# EAGLE design openegg2 (EAGLE 6.1)
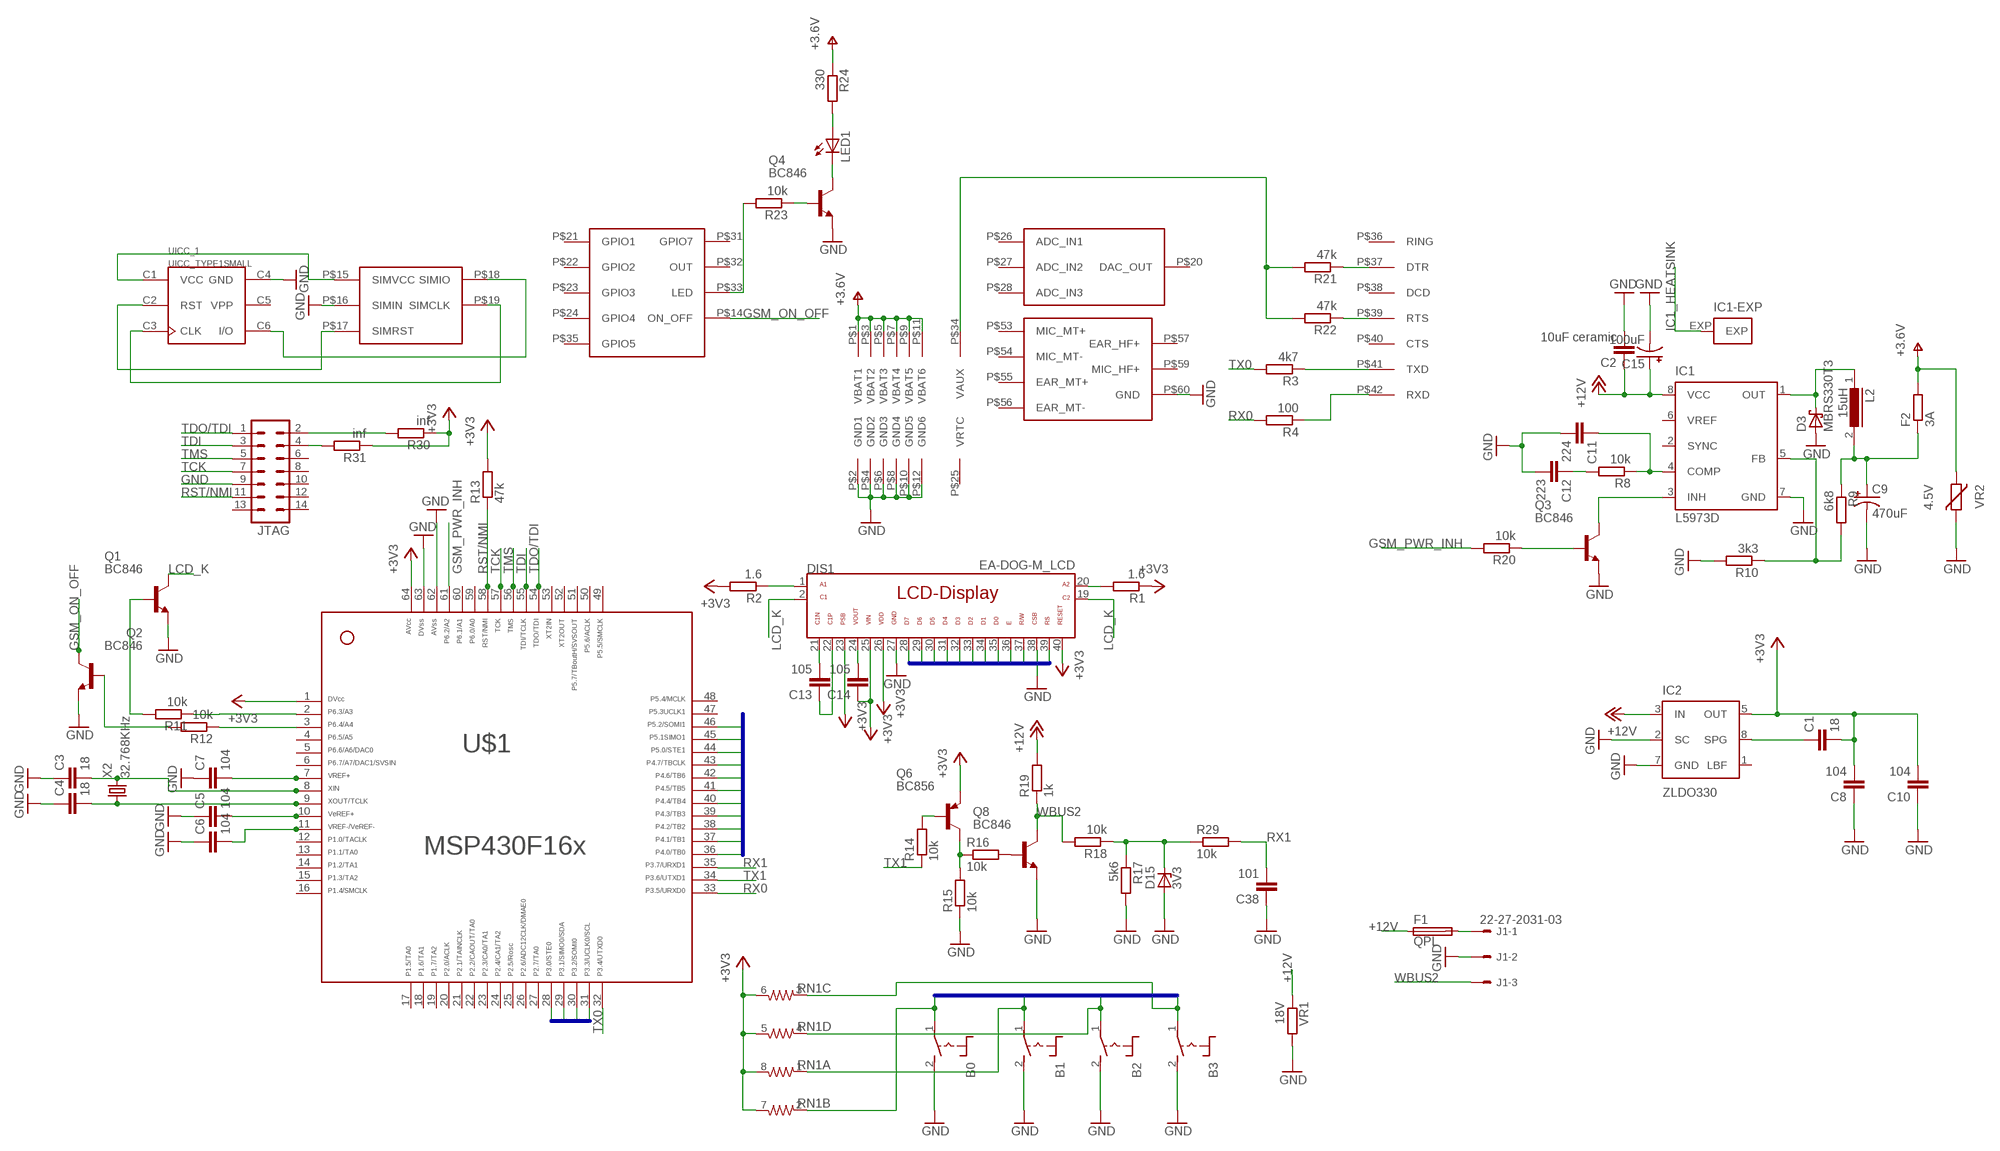
[diagram p0: schematic, sheet 1]

## Parts
B0  MARQ6424  [MARQ6424_NOLED]
B1  MARQ6424  [MARQ6424_NOLED]
B2  MARQ6424  [MARQ6424_NOLED]
B3  MARQ6424  [MARQ6424_NOLED]
C1  18  C-EUC0603  [C0603]
C2  10uF ceramic  C-EUC1210K  [C1210K]
C3  18  C-EUC0603  [C0603]
C4  18  C-EUC0603  [C0603]
C5  104  C-EUC0603  [C0603]
C6  104  C-EUC0603  [C0603]
C7  104  C-EUC0603  [C0603]
C8  104  C-EUC1206  [C1206]
C9  470uF  CPOL-USCT7343  [CT7343]
C10  104  C-EUC1206  [C1206]
C11  224  C-EUC0402  [C0402]
C12  223  C-EUC0402  [C0402]
C13  105  C-EUC1206  [C1206]
C14  105  C-EUC1206  [C1206]
C15  100uF  CPOL-US153CLV-0505  [153CLV-0505]
C38  101  C-EUC0402  [C0402]
D3  MBRS330T3  [SMC]
D15  3V3  ZENER-DIODESOD80C  [SOD80C]
DIS1  EA-DOG-M_LCD  [EA-DOG-M_LCD]
F1  QPL  [QPL]
F2  3A  R-EU_R2010  [R2010]
IC1  L5973D  [HSOP8]
IC2  ZLDO330  [SM8]
J1  22-27-2031-03  [6410-03]
JTAG  MA07-2  [MA07-2]
L2  15uH  DR127  [DR127]
LED1  LEDCHIP-LED0603  [CHIP-LED0603]
Q1  BC846  BC846ALT1SMD  [SOT23]
Q2  BC846  BC846ALT1SMD  [SOT23]
Q3  BC846  BC846ALT1SMD  [SOT23]
Q4  BC846  BC846ALT1SMD  [SOT23]
Q6  BC856  BC856ALT1SMD  [SOT23-BEC]
Q8  BC846  BC846ALT1SMD  [SOT23]
R1  1.6  R-EU_R1206  [R1206]
R2  1.6  R-EU_R1206  [R1206]
R3  4k7  R-EU_R0603  [R0603]
R4  100  R-EU_R0603  [R0603]
R8  10k  R-EU_R0603  [R0603]
R9  6k8  R-EU_R0603  [R0603]
R10  3k3  R-EU_R0603  [R0603]
R11  10k  R-EU_R0603  [R0603]
R12  10k  R-EU_R0603  [R0603]
R13  47k  R-EU_R0603  [R0603]
R14  10k  R-EU_R0603  [R0603]
R15  10k  R-EU_R0603  [R0603]
R16  10k  R-EU_R0603  [R0603]
R17  5k6  R-EU_R0603  [R0603]
R18  10k  R-EU_R0603  [R0603]
R19  1k  R-EU_R0603  [R0603]
R20  10k  R-EU_R0603  [R0603]
R21  47k  R-EU_R0603  [R0603]
R22  47k  R-EU_R0603  [R0603]
R23  10k  R-EU_R0603  [R0603]
R24  330  R-EU_R0603  [R0603]
R29  10k  R-EU_R0603  [R0603]
R30  inf  R-EU_R0603  [R0603]
R31  inf  R-EU_R0603  [R0603]
RN1  742-8_S  [742-8]
U$1  F16X---PM64  [PM/PAG64]
U$2  GC864-QUAD-C2SMD  [GC864-QUAD-C2_SMD]
UICC_1  UICC_TYPE1SMALL  [UICC_READER2]
VR1  18V  R-EU_R2010  [R2010]
VR2  4.5V  VARISTORCN1812  [CT/CN1812]
X2  32.768KHz  CRYSTALTC26V  [TC26V]

## Nets
+3V3: C1.2 C8.2 C10.2 C14.1 DIS1.23 DIS1.25 DIS1.26 DIS1.40 IC2.5(OUT) Q6.E R1.1 R2.2 R13.2 R30.1 R31.1 RN1.5 RN1.6 RN1.7 RN1.8 U$1.1 U$1.64
+12V [+12V]: C2.1 C15.+ F1.1 IC1.8(VCC) IC2.3(IN) R19.2 VR1.1
B0: B0.1(P) RN1.2 U$1.30
B1: B1.1(P) RN1.1 U$1.31
B2: B2.1(P) RN1.4 U$1.28
B3: B3.1(P) RN1.3 U$1.29
D0: DIS1.35 U$1.36
D1: DIS1.34 U$1.37
D2: DIS1.33 U$1.38
D3: DIS1.32 U$1.39
D4: DIS1.31 U$1.40
D5: DIS1.30 U$1.41
D6: DIS1.29 U$1.42
D7: DIS1.28 U$1.43
E: DIS1.36 U$1.45
GND: B0.2(S) B1.2(S) B2.2(S) B3.2(S) C2.2 C3.1 C4.1 C5.1 C6.1 C7.1 C8.1 C9.- C10.1 C11.2 C12.2 C15.- C38.1 D3.A D15.A DIS1.27 DIS1.38 IC1.7(GND) IC2.2(SC) IC2.7(GND) J1.2 JTAG.9 Q1.2(E) Q2.2(E) Q3.2(E) Q4.2(E) Q8.2(E) R10.2 R15.1 R17.2 U$1.62 U$1.63 U$2.P$2(GND1) U$2.P$4(GND2) U$2.P$6(GND3) U$2.P$8(GND4) U$2.P$10(GND5) U$2.P$12(GND6) U$2.P$16(SIMIN) U$2.P$60(GND) UICC_1.C4(GND) VR1.2 VR2.1
GSM_ON_OFF: Q2.3(C) U$2.P$14(ON_OFF)
GSM_PWR_INH: R20.2 U$1.61
IC1_HEATSINK: IC1.EXP
LCD_K: DIS1.2 DIS1.19 Q1.3(C)
N$1: DIS1.1 R2.1
N$2: DIS1.20 R1.2
N$3: R3.1 U$2.P$41(TXD)
N$4: R4.1 U$2.P$42(RXD)
N$6: C1.1 IC2.8(SPG)
N$7: C4.2 U$1.9 X2.1
N$8: JTAG.2 R30.2
N$9: JTAG.4 R31.2
N$12: IC1.5(FB) R9.2 R10.1
N$13: C9.+ F2.1 L2.2 R9.1
N$15: D3.C IC1.1(OUT) L2.1
N$16: C11.1 IC1.4(COMP) R8.1
N$17: C12.1 R8.2
N$18: R11.1 U$1.2
N$19: Q1.1(B) R11.2
N$20: R12.1 U$1.3
N$21: Q2.1(B) R12.2
N$22: C13.2 DIS1.21
N$23: C13.1 DIS1.22
N$24: Q3.1(B) R20.1
N$25: C14.2 DIS1.24
N$26: C3.2 U$1.8 X2.2
N$27: Q6.B R14.2
N$28: Q6.C R15.2 R16.1
N$29: C5.2 U$1.10
N$30: C6.2 U$1.11
N$31: C7.2 U$1.7
N$32: IC1.3(INH) Q3.3(C)
N$33: Q8.1(B) R16.2
N$34: F1.2 J1.1
N$35: R22.1 U$2.P$39(RTS)
N$36: R21.1 U$2.P$37(DTR)
N$37: R21.2 R22.2 U$2.P$34(VAUX)
N$38: R23.2 U$2.P$33(LED)
N$39: LED1.A R24.2
N$40: Q4.1(B) R23.1
N$41: LED1.C Q4.3(C)
NET$22: D15.C R17.1 R18.1 R29.1
RS: DIS1.39 U$1.46
RST/NMI: JTAG.11 R13.1 U$1.58
RW: DIS1.37 U$1.44
RX0: R4.2 U$1.33
RX1: C38.2 R29.2 U$1.35
SIMCLK: U$2.P$19(SIMCLK) UICC_1.C3(CLK)
SIMIO: U$2.P$18(SIMIO) UICC_1.C6(I/O)
SIMRST: U$2.P$17(SIMRST) UICC_1.C2(RST)
SIMVCC: U$2.P$15(SIMVCC) UICC_1.C1(VCC)
TCK: JTAG.7 U$1.57
TDI: JTAG.3 U$1.55
TDO/TDI: JTAG.1 U$1.54
TMS: JTAG.5 U$1.56
TX0: R3.2 U$1.32
TX1: R14.1 U$1.34
V+ [V+]: F2.2 R24.1 U$2.P$1(VBAT1) U$2.P$3(VBAT2) U$2.P$5(VBAT3) U$2.P$7(VBAT4) U$2.P$9(VBAT5) U$2.P$11(VBAT6) VR2.2 ; supply symbol labelled +3.6V
WBUS2: J1.3 Q8.3(C) R18.2 R19.1
Unconnected: IC1.2(SYNC) IC1.6(VREF) IC2.1(LBF) JTAG.6 JTAG.8 JTAG.10 JTAG.12 JTAG.13 JTAG.14 U$1.4 U$1.5 U$1.6 U$1.12 U$1.13 U$1.14 U$1.15 U$1.16 U$1.17 U$1.18 U$1.19 U$1.20 U$1.21 U$1.22 U$1.23 U$1.24 U$1.25 U$1.26 U$1.27 U$1.47 U$1.48 U$1.49 U$1.50 U$1.51 U$1.52 U$1.53 U$1.59 U$1.60 U$2.P$20(DAC_OUT) U$2.P$21(GPIO1) U$2.P$22(GPIO2) U$2.P$23(GPIO3) U$2.P$24(GPIO4) U$2.P$25(VRTC) U$2.P$26(ADC_IN1) U$2.P$27(ADC_IN2) U$2.P$28(ADC_IN3) U$2.P$31(GPIO7) U$2.P$32(OUT) U$2.P$35(GPIO5) U$2.P$36(RING) U$2.P$38(DCD) U$2.P$40(CTS) U$2.P$53(MIC_MT+) U$2.P$54(MIC_MT-) U$2.P$55(EAR_MT+) U$2.P$56(EAR_MT-) U$2.P$57(EAR_HF+) U$2.P$59(MIC_HF+) UICC_1.C5(VPP)

## Buses
D0,D1,D2,D3,D4,D5,D6,D7,RW,E,RS
B0,B1,B2,B3

## Library data of the parts
B0 B1-B3 = misc:MARQ6424
C1-C8 C10-C14 C38 = rcl:C-EU: CAPACITOR, European symbol
C9 C15 = rcl:CPOL-US: POLARIZED CAPACITOR, American symbol
D3 = diode:MBRS3*0T3: SCHOTTKY BARRIER RECTIFIER 3.0 AMPERES 20, 30, 40 VOLT Source: MBRS340T3-D.pdf
D15 = diode:ZENER-DIODE: Z-Diode
DIS1 = 1_USER:EA-DOG-M_LCD
F1 = fuse:QPL: Fuseholder for Micro(TM) Fuse or Pico(R) II Fuses 281 005, 281 008 Source:www.littlefuse.com .. 281005A.PDF; OC_FARNELL: 1608231; OC_NEWARK: unknown
F2 R1-R4 R8-R24 R29-R31 VR1 = rcl:R-EU_: RESISTOR, European symbol
IC1 = st-microelectronics:L5973D: 2.5 A switch step down switching regulator Source: Data sheet <http://www.st.com/internet/com/TECHNICAL_RESOURCES/TECHNICAL_LITERATURE/DATASHEET/CD00002851.pdf>; MF: STMICROELECTRONICS; MPN: L5973D; OC_FARNELL: 1077145
IC2 = 1_USER:ZLDO330
J1 = con-molex:22-?-03: CONNECTOR wire to board 2.54 mm (.1 inch) pitch header; OC_FARNELL: unknown; OC_NEWARK: unknown
JTAG = con-lstb:MA07-2: PIN HEADER
L2 = inductors-2:DR127: High Power Density, High Efficiency, Shielded Inductors Source: coiltronics_dr_series.pdf
LED1 = led:LED: LED OSRAM: - CHIPLED LG R971, LG N971, LY N971, LG Q971, LY Q971, LO R971, LY R971 LH N974, LH R974 LS Q976, LO Q976, LY Q976 LO Q996 - Hyper CHIPLED LW Q18S LB Q993, LB Q99A, LB R99A - SideLED LS A670, LO A670, LY A670, LG A670, LP A670 LB A673, LV A673, LT A673, LW A673 LH A674 LY A675 LS A676, LA A676, LO A676, LY A676, LW A676 LS A679, LY A679, LG A679 - Hyper Micro SIDELED® LS Y876, LA Y876, LO Y876, LY Y876 LT Y87S - SmartLED LW L88C, LW L88S LB L89C, LB L89S, LG L890 LS L89K, LO L89K, LY L89K LS L896, LA L896, LO L896, LY L896 - TOPLED LS T670, LO T670, LY T670, LG T670, LP T670 LSG T670, LSP T670, LSY T670, LOP T670, LYG T670 LG T671, LOG T671, LSG T671 LB T673, LV T673, LT T673, LW T673 LH T674 LS T676, LA T676, LO T676, LY T676, LB T676, LH T676, LSB T676, LW T676 LB T67C, LV T67C, LT T67C, LS T67K, LO T67K, LY T67K, LW E67C LS E67B, LA E67B, LO E67B, LY E67B, LB E67C, LV E67C, LT E67C LW T67C LS T679, LY T679, LG T679 LS T770, LO T770, LY T770, LG T770, LP T770 LB T773, LV T773, LT T773, LW T773 LH T774 LS E675, LA E675, LY E675, LS T675 LS T776, LA T776, LO T776, LY T776, LB T776 LHGB T686 LT T68C, LB T68C - Hyper Mini TOPLED® LB M676 - Mini TOPLED Santana® LG M470 LS M47K, LO M47K, LY M47K Source: http://www.osram.convergy.de LUXEON: - LUMILED® LXK2-PW12-R00, LXK2-PW12-S00, LXK2-PW14-U00, LXK2-PW14-V00 LXK2-PM12-R00, LXK2-PM12-S00, LXK2-PM14-U00 LXK2-PE12-Q00, LXK2-PE12-R00, LXK2-PE12-S00, LXK2-PE14-T00, LXK2-PE14-U00 LXK2-PB12-K00, LXK2-PB12-L00, LXK2-PB12-M00, LXK2-PB14-N00, LXK2-PB14-P00, LXK2-PB14-Q00 LXK2-PR12-L00, LXK2-PR12-M00, LXK2-PR14-Q00, LXK2-PR14-R00 LXK2-PD12-Q00, LXK2-PD12-R00, LXK2-PD12-S00 LXK2-PH12-R00, LXK2-PH12-S00 LXK2-PL12-P00, LXK2-PL12-Q00, LXK2-PL12-R00 Source: www.luxeon.com KINGBRIGHT: KA-3528ASYC Source: www.kingbright.com
Q1-Q4 Q8 = transistor-npn:BC846*: NPN Transistor
Q6 = transistor-pnp:BC856*: PNP Transistror
RN1 = resistor-array:742-8_S: CTS 742 Series 8 Terminations, 4 Resistors
U$1 = TI_MSP430_v13:F16X---PM64: *** MSP430F16x *** PM64
U$2 = misc:GC864-QUAD-C2: Telit GC864-QUAD-C2 GSM/GPRS module
UICC_1 = uicc_card_reader:UICC_TYPE1: UICC type 1 card holder UMTS UICC and GSM SIM cards have the same form factor and pinout. This card holder (type 1) includes a SIM presence pin.
VR2 = varistor:VARISTOR: VARISTOR
X2 = crystal:CRYSTAL: CRYSTAL

## Net classes
0 default: clearance 0.127 mm
1 V+: width 0.508 mm, clearance 0.305 mm
2 +12V: width 0.508 mm, clearance 0.305 mm
3 +3V3: width 0.508 mm, clearance 0.305 mm

## Board
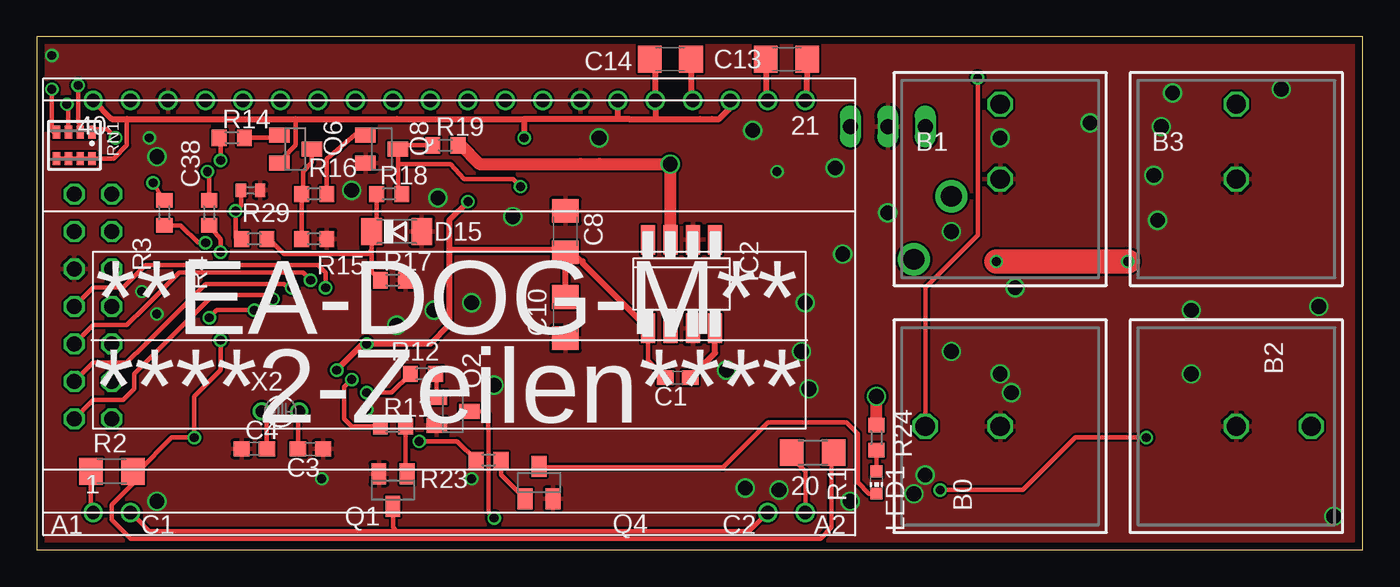
[diagram p1: board, top side]
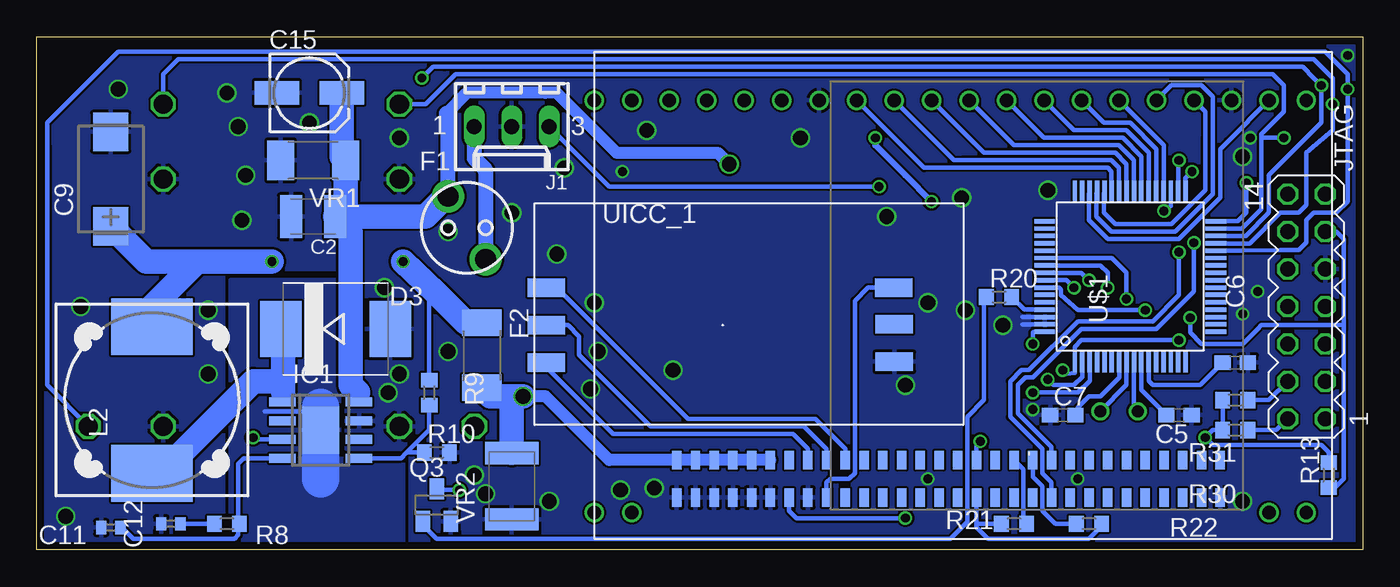
[diagram p2: board, bottom side, seen from below]

Size 89.84 x 34.79 mm. Coordinates in mm from the lower left corner, seen from the top.
Outline: 0,0 89.84,0 89.84,34.79 0,34.79 0,0
Copper layers (1*16): Top 0.035mm / dielectric 1.5mm / Bottom 0.035mm
Design rules: minimum track width 6mil, minimum drill 0.3mm, track to track 6mil, track to pad 6mil, pad to pad 6mil, via to via 6mil, smd to smd 6mil, copper to edge 20mil, drill to drill 10mil, minimum pad ring 8mil, minimum via ring 6mil, stop-mask expansion 3mil, vias tented up to drill 0mil, thermal gap 8mil

### Footprints (pad centres in the part's own frame; a part is rotated, then mirrored left to right if it is on the bottom)
MARQ6424_NOLED = drill 1.3 octagon: 1 0,5.08; 2 0,0
C0603 = smd 1.1 x 1: 1 -0.85,0; 2 0.85,0
C1210K = smd 1.5 x 2.9: 1 -1.5,0; 2 1.5,0
C1206 = smd 1.6 x 1.8: 1 -1.4,0; 2 1.4,0
CT7343 = smd 2.6 x 2.4: + -3.2,0; - 3.2,0
C0402 = smd 0.7 x 0.9: 1 -0.65,0; 2 0.65,0
153CLV-0505 = smd 3 x 1.6: + 2.2,0; - -2.2,0
SMC = smd 2.8 x 3.8: A 3.7,0; C -3.7,0
SOD80C = smd 1.4 x 1.8: A 1.7,0; C -1.7,0
EA-DOG-M_LCD = drill 0.9: 1 -24.13,-27.94; 2 -21.59,-27.94; 19 21.59,-27.94; 20 24.13,-27.94; 21 24.13,0; 22 21.59,0; 23 19.05,0; 24 16.51,0; 25 13.97,0; 26 11.43,0; 27 8.89,0; 28 6.35,0; 29 3.81,0; 30 1.27,0; 31 -1.27,0; 32 -3.81,0; 33 -6.35,0; 34 -8.89,0; 35 -11.43,0; 36 -13.97,0; 37 -16.51,0; 38 -19.05,0; 39 -21.59,0; 40 -24.13,0
QPL = drill 1.4 pad 2.184: 1 -1.27,2.139; 2 1.27,-2.139
R2010 = smd 1.8 x 2.7: 1 -2.2,0; 2 2.2,0
HSOP8 = smd 0.6 x 1.8: 1 -1.905,-2.6; 2 -0.635,-2.6; 3 0.635,-2.6; 4 1.905,-2.6; 5 1.905,2.6; 6 0.635,2.6; 7 -0.635,2.6; 8 -1.905,2.6 | smd 3.2 x 2.51: EXP 0,0
SM8 = smd 0.95 x 2: 1 -2.28,-3; 2 -0.76,-3; 3 0.76,-3; 4 2.28,-3; 5 2.28,3; 6 0.76,3; 7 -0.76,3; 8 -2.28,3
6410-03 = drill 1.016 long: 1 2.54,0; 2 0,0; 3 -2.54,0
MA07-2 = drill 1.016 octagon: 1 -7.62,-1.27; 2 -7.62,1.27; 3 -5.08,-1.27; 4 -5.08,1.27; 5 -2.54,-1.27; 6 -2.54,1.27; 7 0,-1.27; 8 0,1.27; 9 2.54,-1.27; 10 2.54,1.27; 11 5.08,-1.27; 12 5.08,1.27; 13 7.62,-1.27; 14 7.62,1.27
DR127 = smd 3.85 x 5.5: 1 -4.975,0; 2 4.975,0
CHIP-LED0603 = smd 0.8 x 0.8: A 0,-0.75; C 0,0.75
SOT23 = smd 1 x 1.4: 1 -0.95,-1.1; 2 0.95,-1.1; 3 0,1.1
SOT23-BEC = smd 1 x 1.4: B -0.95,-1.1; C 0,1.1; E 0.95,-1.1
R1206 = smd 1.6 x 1.803: 1 -1.422,0; 2 1.422,0
R0603 = smd 1 x 1.1: 1 -0.85,0; 2 0.85,0
742-8 = smd 0.5 x 0.9: 1 -1.2,-0.9; 2 -0.4,-0.9; 3 0.4,-0.9; 4 1.2,-0.9; 5 1.2,0.9; 6 0.4,0.9; 7 -0.4,0.9; 8 -1.2,0.9
PM/PAG64 = smd 1.4 x 0.3: 1 -5.8,3.75; 2 -5.8,3.25; 3 -5.8,2.75; 4 -5.8,2.25; 5 -5.8,1.75; 6 -5.8,1.25; 7 -5.8,0.75; 8 -5.8,0.25; 9 -5.8,-0.25; 10 -5.8,-0.75; 11 -5.8,-1.25; 12 -5.8,-1.75; 13 -5.8,-2.25; 14 -5.8,-2.75; 15 -5.8,-3.25; 16 -5.8,-3.75; 33 5.8,-3.75; 34 5.8,-3.25; 35 5.8,-2.75; 36 5.8,-2.25; 37 5.8,-1.75; 38 5.8,-1.25; 39 5.8,-0.75; 40 5.8,-0.25; 41 5.8,0.25; 42 5.8,0.75; 43 5.8,1.25; 44 5.8,1.75; 45 5.8,2.25; 46 5.8,2.75; 47 5.8,3.25; 48 5.8,3.75 | smd 0.3 x 1.4: 17 -3.75,-5.8; 18 -3.25,-5.8; 19 -2.75,-5.8; 20 -2.25,-5.8; 21 -1.75,-5.8; 22 -1.25,-5.8; 23 -0.75,-5.8; 24 -0.25,-5.8; 25 0.25,-5.8; 26 0.75,-5.8; 27 1.25,-5.8; 28 1.75,-5.8; 29 2.25,-5.8; 30 2.75,-5.8; 31 3.25,-5.8; 32 3.75,-5.8; 49 3.75,5.8; 50 3.25,5.8; 51 2.75,5.8; 52 2.25,5.8; 53 1.75,5.8; 54 1.25,5.8; 55 0.75,5.8; 56 0.25,5.8; 57 -0.25,5.8; 58 -0.75,5.8; 59 -1.25,5.8; 60 -1.75,5.8; 61 -2.25,5.8; 62 -2.75,5.8; 63 -3.25,5.8; 64 -3.75,5.8
GC864-QUAD-C2_SMD = smd 0.635 x 1.27: P$1 -18.542,-12.446; P$2 -18.542,-14.986; P$3 -17.272,-12.446; P$4 -17.272,-14.986; P$5 -16.002,-12.446; P$6 -16.002,-14.986; P$7 -14.732,-12.446; P$8 -14.732,-14.986; P$9 -13.462,-12.446; P$10 -13.462,-14.986; P$11 -12.192,-12.446; P$12 -12.192,-14.986; P$13 -10.922,-12.446; P$14 -10.922,-14.986; P$15 -9.652,-12.446; P$16 -9.652,-14.986; P$17 -8.382,-12.446; P$18 -8.382,-14.986; P$19 -7.112,-12.446; P$20 -7.112,-14.986; P$21 -5.842,-12.446; P$22 -5.842,-14.986; P$23 -4.572,-12.446; P$24 -4.572,-14.986; P$25 -3.302,-12.446; P$26 -3.302,-14.986; P$27 -2.032,-12.446; P$28 -2.032,-14.986; P$29 -0.762,-12.446; P$30 -0.762,-14.986; P$31 0.508,-12.446; P$32 0.508,-14.986; P$33 1.778,-12.446; P$34 1.778,-14.986; P$35 3.048,-12.446; P$36 3.048,-14.986; P$37 4.318,-12.446; P$38 4.318,-14.986; P$39 5.588,-12.446; P$40 5.588,-14.986; P$41 6.858,-12.446; P$42 6.858,-14.986; P$43 8.128,-12.446; P$44 8.128,-14.986; P$45 9.398,-12.446; P$46 9.398,-14.986; P$47 10.668,-12.446; P$48 10.668,-14.986; P$49 11.938,-12.446; P$50 11.938,-14.986; P$51 13.208,-12.446; P$52 13.208,-14.986; P$53 14.478,-12.446; P$54 14.478,-14.986; P$55 15.748,-12.446; P$56 15.748,-14.986; P$57 17.018,-12.446; P$58 17.018,-14.986; P$59 18.288,-12.446; P$60 18.288,-14.986
UICC_READER2 = smd 2.54 x 1.27: C1 -17.218,-2.54; C2 -17.218,0; C3 -17.218,2.54; C4 6.362,-2.475; C5 6.358,0.06; C6 6.338,2.54
CT/CN1812 = smd 1.5 x 3.6: 1 -2.25,0; 2 2.25,0
TC26V = drill 0.813: 1 -1.27,0; 2 1.27,0

### Placement (x,y rotation side)
B0  65.28,8.38 90 top
B1  65.28,25.15 0 top
B2  81.28,8.38 270 top
B3  81.28,25.15 0 top
C1  43.43,11.68 180 top
C2  71.12,22.61 180 bottom
C3  18.54,6.86 180 top
C4  14.73,6.86 0 top
C5  12.45,9.14 180 bottom
C6  8.64,12.7 180 bottom
C7  20.32,9.14 0 bottom
C8  35.81,21.59 270 top
C9  84.84,25.15 90 bottom
C10  35.81,15.75 90 top
C11  84.84,1.52 180 bottom
C12  80.77,1.78 180 bottom
C13  50.8,33.27 0 top
C14  42.93,33.27 0 top
C15  71.37,30.99 0 bottom
C38  14.48,24.38 180 top
D3  69.6,14.99 0 bottom
D15  24.38,21.59 0 top
DIS1  27.94,30.48 0 top
F1  60.71,21.84 0 bottom
F2  59.69,13.21 270 bottom
IC1  70.61,8.13 270 bottom
IC2  43.69,18.03 180 top
J1  57.66,28.7 180 bottom
JTAG  3.81,16.51 90 bottom
L2  82.04,10.16 90 bottom
LED1  56.9,4.57 180 top
Q1  24.13,4.06 180 top
Q2  28.19,9.4 270 top
Q3  62.74,3.05 0 bottom
Q4  34.04,4.57 0 top
Q6  17.53,27.18 270 top
Q8  23.37,27.18 270 top
R1  52.58,6.6 180 top
R2  5.08,5.33 0 top
R3  8.64,22.86 90 top
R4  11.68,22.86 90 top
R8  76.96,1.78 180 bottom
R9  63.25,10.67 270 bottom
R10  62.74,6.6 0 bottom
R11  24.13,8.38 0 top
R12  26.16,11.94 0 top
R13  2.29,5.08 90 bottom
R14  13.21,27.94 0 top
R15  18.8,21.08 180 top
R16  18.8,24.13 0 top
R17  24.13,18.29 0 top
R18  23.88,24.13 0 top
R19  27.69,27.43 0 top
R20  24.64,17.14 0 bottom
R21  23.62,1.78 180 bottom
R22  18.54,1.78 0 bottom
R23  30.61,6.1 180 top
R24  56.9,7.62 270 top
R29  14.73,21.08 180 top
R30  8.64,8.13 0 bottom
R31  8.64,10.16 0 bottom
RN1  2.54,27.43 180 top
U$1  15.75,18.54 90 bottom
U$2  27.94,18.54 0 bottom
UICC_1  38.1,15.24 0 bottom
VR1  71.12,26.42 180 bottom
VR2  57.66,4.32 90 bottom
X2  16.51,9.4 0 top

### Tracks (layer width: path | path; a pad name or v marks a point on that pad's centre or on a via)
+3V3  (via drill 0.6)
  Top 0.305: 22.35,14.22 v22.35,13.97 | 12.95,0.76 6.35,0.76 5.08,2.03 5.08,3.05 6.5,4.47 R2.2 6.86,5.33 9.14,7.62 v10.67,7.62 10.67,10.41 12.45,12.19 v12.45,14.22 | 12.95,0.76 13.21,0.76 | 13.21,0.76 16.26,0.76 25.91,0.76 53.09,0.76 53.85,1.52 53.85,6.71 R1.1 | Q6.E 16.58,26.48 17.53,27.43 17.53,29.21 | 13.21,0.76 12.95,0.76 | C1.2 41.41,12.86 IC2.5 | 6.1,29.21 6.1,27.43 5.2,26.53 5.08,26.53 RN1.8 RN1.7 RN1.6 RN1.5
  Top 0.406: v20.32,12.19 22.35,14.22 | DIS1.40 5.08,29.21 6.1,29.21 17.53,29.21 24.38,29.21 33.02,29.21 | 41.91,29.21 40.13,29.21 39.37,29.21 | 41.91,29.21 44.96,29.21 45.72,29.21 46.23,29.21 46.99,29.97 DIS1.23 | 41.91,29.21 DIS1.25 41.91,32.89 C14.1 | 33.02,29.21 v33.02,27.94 | 27.94,20.32 27.94,22.35 v29.21,23.62 | 27.94,20.32 27.94,15.24 26.67,13.97 v22.35,13.97 | 39.37,29.21 33.02,29.21 | 39.37,29.21 39.37,30.23 DIS1.26 | IC2.5 36.98,19.46 | 36.98,19.46 36.12,20.32 27.94,20.32 | 36.98,19.46 36.98,19.58 C8.2 C10.2
  Bottom 0.305: v20.32,12.19 20.07,11.94 19.5,12 U$1.1 19.5,13.78 19.05,14.22 v12.45,14.22 | v22.35,13.97 22.35,14.73 22.29,14.79 U$1.64 | R31.1 R30.1 10.16,8.13 v10.67,7.62 10.16,7.11 2.79,7.11 2.29,6.6 R13.2
  Bottom 0.406: v33.02,27.94 33.02,27.43 30.99,25.4 v29.21,23.62
+12V  (via drill 1)
  Top 0.813: R19.2 28.7,27.43 29.97,26.16 36.83,26.16 38.1,26.16 v42.93,26.16 IC2.3
  Bottom 0.61: 68.07,10.67 68.07,10.09 IC1.8
  Bottom 0.813: v42.93,26.16 43.69,26.92 50.55,26.92 54.61,30.99 55.37,30.99 60.71,30.99 62.1,29.59
  Bottom 1.016: F1.1 61.98,29.46 62.1,29.59
  Bottom 1.676: 68.07,10.67 68.58,11.18 68.58,19.05 68.58,21.57 C2.1 69.1,23.13 | F1.1 62.12,23.98 63.5,22.61 68.58,22.61 69.1,23.13 | C15.+ 69.17,26.67 VR1.1 68.92,23.31 69.1,23.13
B0  (via drill 0.6)
  Top 0.305: v63.75,32 63.75,21.34 60.2,17.78 B0.1 | RN1.2 2.94,28.81 2.79,28.96 v2.79,31.5
  Bottom 0.305: U$1.30 7.92,21.29 6.35,22.86 6.35,25.4 2.79,28.96 | 2.79,28.96 2.79,31.24 | v63.75,32 62.99,32.77 62.23,32.77 4.06,32.77 3.3,32 v2.79,31.5 2.79,28.96
B1  (via drill 0.6)
  Top 0.305: v5.33,27.94 4.76,28.52 3.93,28.52 RN1.1
  Bottom 0.305: U$1.31 8.18,21.79 6.86,23.11 6.86,27.94 | 6.86,27.94 6.86,28.19 5.33,29.72 5.33,31.5 6.1,32.26 61.47,32.26 63.5,30.23 B1.1 | v5.33,27.94 6.86,27.94
B2  (via drill 0.6)
  Top 0.305: RN1.4 1.13,28.33 1.02,28.45 v1.02,31.24
  Bottom 0.305: U$1.28 8.16,20.29 5.59,20.32 4.32,20.32 3.81,20.83 3.81,22.1 3.81,22.35 3.3,22.86 2.03,22.86 1.78,22.86 1.02,23.62 1.02,25.4 1.02,25.65 1.02,27.43 1.02,28.7 v1.02,31.24 | v1.02,31.24 1.02,30.99 | 1.02,30.99 1.02,32.26 2.54,33.78 84.33,33.78 87.63,30.48 89.15,28.96 89.15,27.43 89.15,14.73 89.15,11.18 B2.1 | v1.02,31.24 1.02,30.99
B3  (via drill 0.6)
  Top 0.305: RN1.3 2.14,29.86 v2.03,30.23
  Bottom 0.305: U$1.29 7.66,20.79 5.59,22.86 4.32,22.86 3.81,23.37 3.81,26.92 2.03,28.45 v2.03,30.23 | v2.03,30.23 2.03,30.48 | 2.03,30.48 2.03,32 3.3,33.27 80.26,33.27 81.28,32.26 B3.1 | v2.03,30.23 2.03,30.48
D0
  Bottom 0.305: DIS1.35 13.46,27.43 13.46,24.38 U$1.36
D1
  Bottom 0.305: U$1.37 13.97,24.38 13.97,27.18 15.75,28.96 17.53,28.96 DIS1.34
D2
  Bottom 0.305: DIS1.33 19.56,28.45 16,28.45 14.48,26.92 14.48,25.4 U$1.38
D3
  Bottom 0.305: U$1.39 14.99,25.4 14.99,26.67 16.26,27.94 21.59,27.94 DIS1.32
D4
  Bottom 0.305: U$1.40 15.49,25.4 15.49,26.42 16.51,27.43 23.62,27.43 24.89,28.7 DIS1.31
D5
  Bottom 0.305: U$1.41 16,25.4 16,26.16 16.76,26.92 25.65,26.92 DIS1.30
D6
  Bottom 0.305: U$1.42 16.51,25.4 16.51,25.91 17.02,26.42 27.18,26.42 27.69,26.42 DIS1.29
D7
  Bottom 0.305: U$1.43 17.02,25.4 17.02,25.65 17.27,25.91 29.72,25.91 DIS1.28
E
  Bottom 0.305: DIS1.36 12.95,31.5 10.92,31.5 10.16,30.73 10.16,24.13 12.7,21.59 17.02,21.59 18.03,22.61 18.03,24.13 U$1.45
GND  (via drill 0.6, 1)
  Bottom 0.305: U$1.62 23.07,15.79 | U$1.63 23.06,15.29
  other vias: 48.01,4.19 50.29,4.06 51.82,13.46 57.66,22.86 54.61,20.07 61.98,13.46 59.44,3.81 71.37,28.96 65.28,27.94 78.23,16.26 86.87,16.51 55.12,3.3 61.98,21.59 38.1,27.94 29.46,16.76 46.74,12.19 8.13,26.67 8.13,3.3 27.18,23.88 30.99,11.18 32.26,22.61 87.88,2.29 65.28,11.94 21.34,24.38 22.35,9.53 7.11,17.53 8.13,16 7.62,27.94 1.02,33.53 78.23,11.94 54.1,25.91 48.51,28.45 52.07,16.76 52.32,10.92 19.3,4.83 29.46,4.83 50.16,25.65 75.95,22.35 84.33,31.24 24.38,15.24 26.92,16.26 66.29,17.78 66.04,10.67 76.96,30.99 75.69,25.4 76.2,28.7 60.2,5.08
  pour Bottom: 0.25,34.29 89.66,34.29 89.66,0.25 77.22,0.25 77.22,19.05 68.83,19.05 68.83,6.86 64.52,6.86 64.52,0.25 0.25,0
  pour Top: 0.25,34.29 89.41,34.29 89.41,0.25 0.25,0.25
GSM_ON_OFF  (via drill 0.6)
  Top 0.305: v30.99,2.16 30.61,2.54 30.61,7.49 30.56,9.14 30.23,9.4 29.72,9.4 Q2.3
  Bottom 0.305: U$2.P$14 38.86,2.67 38.35,2.16 v30.99,2.16
GSM_PWR_INH
  Bottom 0.305: U$1.61 22.93,16.29 R20.2
IC1_HEATSINK
  Bottom 0.305: 71.12,9.4 74.42,9.4
  Bottom 2.54: 70.61,9.65 70.61,4.83
  pour Bottom: 76.71,18.29 76.71,0.25 65.02,0.25 65.02,6.35 69.34,6.35 69.34,18.29
LCD_K
  Top 0.305: DIS1.2 6.86,2.03 7.62,1.27 24.38,1.27 | DIS1.19 48.26,1.27 24.38,1.27 | Q1.3 24.13,2.29 24.13,1.52 24.38,1.27
N$1
  Top 0.305: R2.1 3.66,2.69 DIS1.1
N$2
  Top 0.305: R1.2 51.16,6.25 52.07,5.33 DIS1.20
N$3  (via drill 0.6)
  Top 0.305: R3.1 9.74,22.01 10.92,20.83 v11.43,20.83
  Bottom 0.305: v11.43,20.83 11.43,17.53 13.97,14.99 16.76,14.99 17.78,14.99 19.05,14.99 22.35,11.68 22.86,11.68 23.37,11.18 23.37,10.92 23.37,9.27 21.08,6.99 U$2.P$41
N$4  (via drill 0.6)
  Top 0.305: R4.1 12.45,21.08 v12.45,20.19
  Bottom 0.305: v12.45,20.19 12.45,17.27 14.22,15.49 16.51,15.49 17.53,15.49 19.3,15.49 22.61,12.19 23.11,12.19 23.88,11.43 23.88,9.02 21.72,6.86 21.72,5.21 21.08,4.57 U$2.P$42
N$6
  Top 0.406: C1.1 45.97,13.37 IC2.8
N$7
  Top 0.305: C4.2 15.58,9.56 X2.1
  Bottom 0.305: U$1.9 15.5,9.66 X2.1
N$8
  Bottom 0.305: R30.2 5.84,8.13 JTAG.2
N$9
  Bottom 0.305: R31.2 6.35,10.16 JTAG.4
N$12
  Bottom 0.305: R10.1 64.77,6.6 | R9.2 63.25,8.13 64.77,6.6 | IC1.5 65.15,6.22 64.77,6.6
N$13  (via drill 0.6)
  Top 1.676: v65.02,19.56 v73.91,19.56
  Bottom 0.305: R9.1 63.25,17.44 62.83,17.44
  Bottom 1.676: v65.02,19.56 62.83,17.44 62.66,17.27 60.79,15.41 F2.1 | 84.84,21.84 C9.+ 82.45,19.56 82.04,19.56 78.99,19.56 | v73.91,19.56 78.23,19.56 78.99,19.56 | L2.2 82.04,16.51 78.99,19.56
N$15
  Bottom 0.305: 73.15,10.67 73.21,10.67 IC1.1
  Bottom 1.676: D3.C 73.15,14.99 73.15,11.43 | 73.15,11.43 73.15,10.67 | L2.1 80.16,6.46 77.22,9.4 75.18,11.43 73.15,11.43
N$16
  Bottom 0.305: C11.1 83.93,1.38 83.31,0.76 82.8,0.76 76.45,0.76 76.2,1.02 76.2,2.12 | IC1.4 75.82,6.22 76.2,5.84 76.2,2.12 | 76.2,2.12 R8.1
N$17
  Bottom 0.305: R8.2 C12.1
N$18  (via drill 0.6)
  Top 0.305: v21.34,11.56 20.83,11.05 20.83,8.89 21.34,8.38 R11.1 | R11.1 23.37,8.13 R11.1
  Bottom 0.305: U$1.2 19,11.74 19.56,11.18 20.95,11.18 v21.34,11.56
N$19
  Top 0.305: R11.2 24.98,5.26 Q1.1
N$20  (via drill 0.6)
  Top 0.305: v22.35,10.67 24.04,10.67 R12.1
  Bottom 0.305: U$1.3 18.5,11.47 19.3,10.67 v22.35,10.67
N$21
  Top 0.305: Q2.1 27.09,11.86 R12.2
N$22
  Top 0.406: C13.2 52.16,30.65 DIS1.21
N$23
  Top 0.406: C13.1 49.4,30.61 DIS1.22
N$24
  Bottom 0.305: Q3.1 63.52,1.52 62.74,0.76 27.94,0.76 26.8,1.91 26.8,9.02 25.65,10.16 25.65,16.98 R20.1
N$25
  Top 0.406: C14.2 44.33,30.6 DIS1.24
N$26
  Top 0.305: C3.2 17.69,9.31 X2.2
  Bottom 0.305: U$1.8 16,11.18 X2.2
N$27
  Top 0.305: R14.2 16.49,27.94 Q6.B
N$28
  Top 0.305: Q6.C 18.63,26.25 18.03,25.65 18.03,24.22 R16.1 R15.2
N$29
  Bottom 0.305: U$1.10 15,10.85 C5.2
N$30
  Bottom 0.305: U$1.11 14.5,11.45 14.22,11.18 11.01,11.18 C6.2
N$31
  Bottom 0.305: U$1.7 16.5,11.7 17.78,10.41 18.45,10.41 | 18.45,10.41 18.54,10.41 | 18.54,10.41 18.45,10.41 | 18.45,10.41 18.54,10.41 | 18.54,10.41 18.45,10.41 | 18.45,10.41 18.54,10.41 | 18.54,10.41 19.3,9.65 C7.2
N$32  (via drill 0.6)
  Top 0.305: v75.18,7.62 70.36,7.62 66.8,4.06 v61.21,4.06
  Bottom 0.305: IC1.3 75.06,7.49 v75.18,7.62 | v61.21,4.06 62.65,4.06 Q3.3
N$33
  Top 0.305: R16.2 19.65,26.5 21.59,28.19 22.2,28.19 Q8.1
N$34
  Bottom 1.016: J1.1 60.2,26.56 59.44,25.8 59.44,25.65 F1.2
N$35
  Bottom 0.305: U$2.P$39 22.35,4.95 21.72,4.32 21.72,2.79 21.72,2.67 20.83,1.78 R22.1
N$36
  Bottom 0.305: U$2.P$37 22.99,5.46 22.99,2.67 22.99,1.99 R21.1
N$37
  Bottom 0.305: 26.16,1.78 U$2.P$34 26.16,1.78 | 26.16,1.78 25.65,1.78 R21.2 | R22.2 17.69,1.61 18.54,0.76 25.4,0.76 26.16,1.52 26.16,1.78
N$38  (via drill 0.6)
  Top 0.305: v25.91,7.37 28.49,7.37 R23.2
  Bottom 0.305: U$2.P$33 26.16,7.11 v25.91,7.37
N$39
  Top 0.305: R24.2 LED1.A
N$40
  Top 0.305: R23.1 31.46,5.1 Q4.1
N$41
  Top 0.305: LED1.C 56.38,3.82 55.63,4.57 55.63,7.87 54.86,8.64 49.53,8.64 46.48,5.59 34.12,5.59 Q4.3
NET$22
  Top 0.305: R18.1 23.03,21.93 D15.C 22.68,20.32 | 22.68,20.32 22.68,18.88 R17.1 | R29.1 15.75,21.08 16.76,20.07 22.43,20.07 22.68,20.32
RS
  Bottom 0.305: DIS1.39 9.14,27.69 9.65,27.18 9.65,23.88 12.45,21.08 17.27,21.08 18.54,22.35 18.54,24.13 U$1.46
RST/NMI  (via drill 0.6)
  Top 0.305: v14.73,16.26 12.19,16.26 v11.68,15.75
  Bottom 0.305: U$1.58 20.59,17.79 20.45,17.65 20.45,17.27 19.3,16.26 16.51,16.26 v14.73,16.26 | v11.68,15.75 11.68,14.73 10.92,13.97 8.13,13.97 7.11,14.99 6.86,15.24 2.03,15.24 1.27,15.24 | JTAG.11 1.78,21.59 1.27,21.08 1.27,20.83 1.27,15.49 1.27,15.24 | R13.1 1.87,4.23 1.27,4.83 1.27,14.99 1.27,15.24
RW
  Bottom 0.305: DIS1.37 10.67,29.72 10.67,27.94 10.67,24.38 12.95,22.1 16.76,22.1 17.53,22.86 17.53,24.13 U$1.44
RX0  (via drill 0.6)
  Top 0.305: v11.56,25.65 11.68,25.53 11.68,23.96 R4.2
  Bottom 0.305: U$1.33 12,25.21 v11.56,25.65
RX1  (via drill 0.6)
  Top 0.305: R29.2 13.46,21.17 13.46,22.1 13.46,22.61 v13.46,22.99 13.83,23.35 C38.2
  Bottom 0.305: U$1.35 13,23.32 v13.46,22.99
SIMCLK
  Bottom 0.305: U$2.P$19 35.05,6.86 37.08,8.89 45.72,8.89 54.61,17.78 UICC_1.C3
SIMIO
  Bottom 0.305: U$2.P$18 36.32,4.57 36.07,4.83 34.8,4.83 34.42,5.21 34.42,16.65 | 34.42,16.65 34.42,16.89 | 34.42,16.89 34.42,16.65 | 34.42,16.65 34.42,16.89 | 34.42,16.89 33.53,17.78 UICC_1.C6
SIMRST
  Bottom 0.305: U$2.P$17 36.32,6.86 37.85,8.38 48.26,8.38 53.09,13.21 53.09,14.48 53.85,15.24 UICC_1.C2
SIMVCC
  Bottom 0.305: U$2.P$15 37.59,6.86 38.61,7.87 50.8,7.87 55.63,12.7 UICC_1.C1
TCK  (via drill 0.6)
  Top 0.305: v19.56,17.78 19.56,18.8 19.05,19.3 18.8,19.3 7.62,19.3 7.37,19.3 5.84,17.78 3.81,17.78 JTAG.7
  Bottom 0.305: U$1.57 20.07,18.29 v19.56,17.78
TDI  (via drill 0.6)
  Top 0.305: v17.27,17.78 17.02,17.78 16.76,18.03 11.43,18.03 7.37,13.97 6.1,12.7 3.81,12.7 JTAG.3
  Bottom 0.305: U$1.55 17.77,19.29 17.27,18.8 v17.27,17.78
TDO/TDI  (via drill 0.6)
  Top 0.305: v16,17.02 15.75,17.27 11.94,17.27 6.6,11.94 6.6,10.92 5.84,10.16 3.81,10.16 JTAG.1
  Bottom 0.305: U$1.54 17,19.79 16,18.8 v16,17.02
TMS  (via drill 0.6)
  Top 0.305: v18.54,18.29 18.03,18.8 9.65,18.8 7.37,16.51 6.1,15.24 3.81,15.24 JTAG.5
  Bottom 0.305: U$1.56 19.05,18.79 v18.54,18.29
TX0  (via drill 0.6)
  Top 0.305: v7.87,24.89 8.64,23.62 R3.2
  Bottom 0.305: U$1.32 8.44,22.29 7.87,22.86 v7.87,24.89
TX1  (via drill 0.6)
  Top 0.305: v12.45,26.42 12.45,28.11 R14.1
  Bottom 0.305: U$1.34 12.5,26.47 v12.45,26.42
V+  (via drill 1)
  Top 0.813: R24.1 v56.9,10.41
  Bottom 0.813: U$2.P$11 U$2.P$9 U$2.P$7 U$2.P$5 U$2.P$3 U$2.P$1 51.05,6.1 55.37,10.41 v56.9,10.41
  Bottom 1.676: v56.9,10.41 57.15,10.41 58.17,10.41 | 58.17,10.41 59.1,10.41 F2.2 | VR2.2 57.66,9.91 58.17,10.41
WBUS2  (via drill 0.6)
  Top 0.305: R19.1 24.64,27.43 24.47,27.26 Q8.3 24.47,26.16 | 24.47,26.16 24.47,24.64 R18.2 | v32.77,24.64 32.26,25.15 28.96,25.15 28.02,26.16 24.47,26.16
  Bottom 0.305: v32.77,24.64 33.02,24.64 51.05,24.64 J1.3